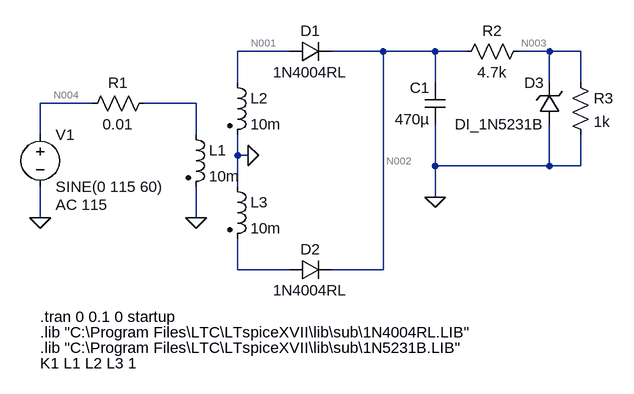
[diagram p0: schematic lab3-PSU.asc]
lab3-PSU.asc, the LTspice schematic file:
Version 4
SHEET 1 952 680
WIRE 432 -16 352 -16
WIRE 576 -16 496 -16
WIRE 656 -16 576 -16
WIRE 704 -16 656 -16
WIRE 832 -16 784 -16
WIRE 880 -16 832 -16
WIRE 352 32 352 -16
WIRE 656 32 656 -16
WIRE 832 32 832 -16
WIRE 880 32 880 -16
WIRE 128 64 48 64
WIRE 288 64 208 64
WIRE 48 112 48 64
WIRE 288 112 288 64
WIRE 352 144 352 112
WIRE 368 144 352 144
WIRE 656 160 656 96
WIRE 832 160 832 96
WIRE 832 160 656 160
WIRE 880 160 880 112
WIRE 880 160 832 160
WIRE 352 192 352 144
WIRE 656 208 656 160
WIRE 48 240 48 192
WIRE 288 240 288 192
WIRE 352 320 352 272
WIRE 432 320 352 320
WIRE 576 320 576 -16
WIRE 576 320 496 320
FLAG 48 240 0
FLAG 288 240 0
FLAG 656 208 0
FLAG 368 144 0
SYMBOL voltage 48 96 R0
WINDOW 123 24 124 Left 2
WINDOW 39 0 0 Left 0
SYMATTR InstName V1
SYMATTR Value SINE(0 115 60)
SYMATTR Value2 AC 115
SYMBOL res 224 48 R90
WINDOW 0 0 56 VBottom 2
WINDOW 3 32 56 VTop 2
SYMATTR InstName R1
SYMATTR Value 0.01
SYMBOL ind2 272 96 R0
SYMATTR InstName L1
SYMATTR Value 10m
SYMATTR Type ind
SYMBOL ind2 336 16 R0
SYMATTR InstName L2
SYMATTR Value 10m
SYMATTR Type ind
SYMBOL ind2 336 176 R0
SYMATTR InstName L3
SYMATTR Value 10m
SYMATTR Type ind
SYMBOL diode 432 0 R270
WINDOW 0 32 32 VTop 2
WINDOW 3 0 32 VBottom 2
SYMATTR InstName D1
SYMATTR Value 1N4004RL
SYMBOL diode 432 336 R270
WINDOW 0 32 32 VTop 2
WINDOW 3 0 32 VBottom 2
SYMATTR InstName D2
SYMATTR Value 1N4004RL
SYMBOL res 800 -32 R90
WINDOW 0 0 56 VBottom 2
WINDOW 3 32 56 VTop 2
SYMATTR InstName R2
SYMATTR Value 4.7k
SYMBOL cap 672 96 R180
WINDOW 0 24 56 Left 2
WINDOW 3 24 8 Left 2
SYMATTR InstName C1
SYMATTR Value 470µ
SYMBOL zener 848 96 R180
WINDOW 0 24 64 Left 2
WINDOW 3 24 0 Left 2
SYMATTR InstName D3
SYMATTR Value DI_1N5231B
SYMATTR Prefix X
SYMBOL res 864 16 R0
SYMATTR InstName R3
SYMATTR Value 1k
TEXT 48 416 Left 2 !.lib "C:\\Program Files\\LTC\\LTspiceXVII\\lib\\sub\\1N4004RL.LIB"
TEXT 48 440 Left 2 !.lib "C:\\Program Files\\LTC\\LTspiceXVII\\lib\\sub\\1N5231B.LIB"
TEXT 48 392 Left 2 !.tran 0 0.1 0 startup
TEXT 48 464 Left 2 !K1 L1 L2 L3 1

The netlist it stands for:
* lab3-PSU.asc
V1 N004 0 SINE(0 115 60) AC 115
R1 N005 N004 0.01
L1 N005 0 10m
L2 N001 0 10m
L3 0 N006 10m
D1 N001 N002 1N4004RL
D2 N006 N002 1N4004RL
R2 N003 N002 4.7k
C1 0 N002 470µ
XD3 0 N003 DI_1N5231B  ; pins + -
R3 N003 0 1k
.model D D
.lib standard.dio
.lib "C:\Program Files\LTC\LTspiceXVII\lib\sub\1N4004RL.LIB"
.lib "C:\Program Files\LTC\LTspiceXVII\lib\sub\1N5231B.LIB"
.tran 0 0.1 0 startup
K1 L1 L2 L3 1
.backanno
.end

* Results of the author's LTspice run, read from the files saved beside the schematic
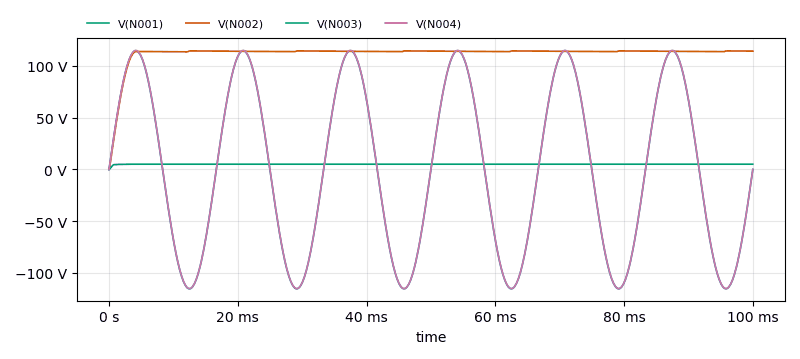
[diagram p1: Transient Analysis of lab3-PSU.asc, plotted from the saved traces]
* Transient Analysis, 1 run:
*   V(N001): min -115.3 V, max 114.7 V, average -299.3 mV, rms 81.28 V, last 29.54 mV
*   V(N002): min 0 V, max 114.5 V, average 112.3 V, rms 112.9 V, last 114.3 V
*   V(N003): min 0 V, max 5.066 V, average 5.04 V, rms 5.047 V, last 5.065 V
*   V(N004): min -115 V, max 115 V, average -2.896 mV, rms 81.31 V, last 0 V